# EAGLE design dus-lmt_breakout (EAGLE 7.7.0)
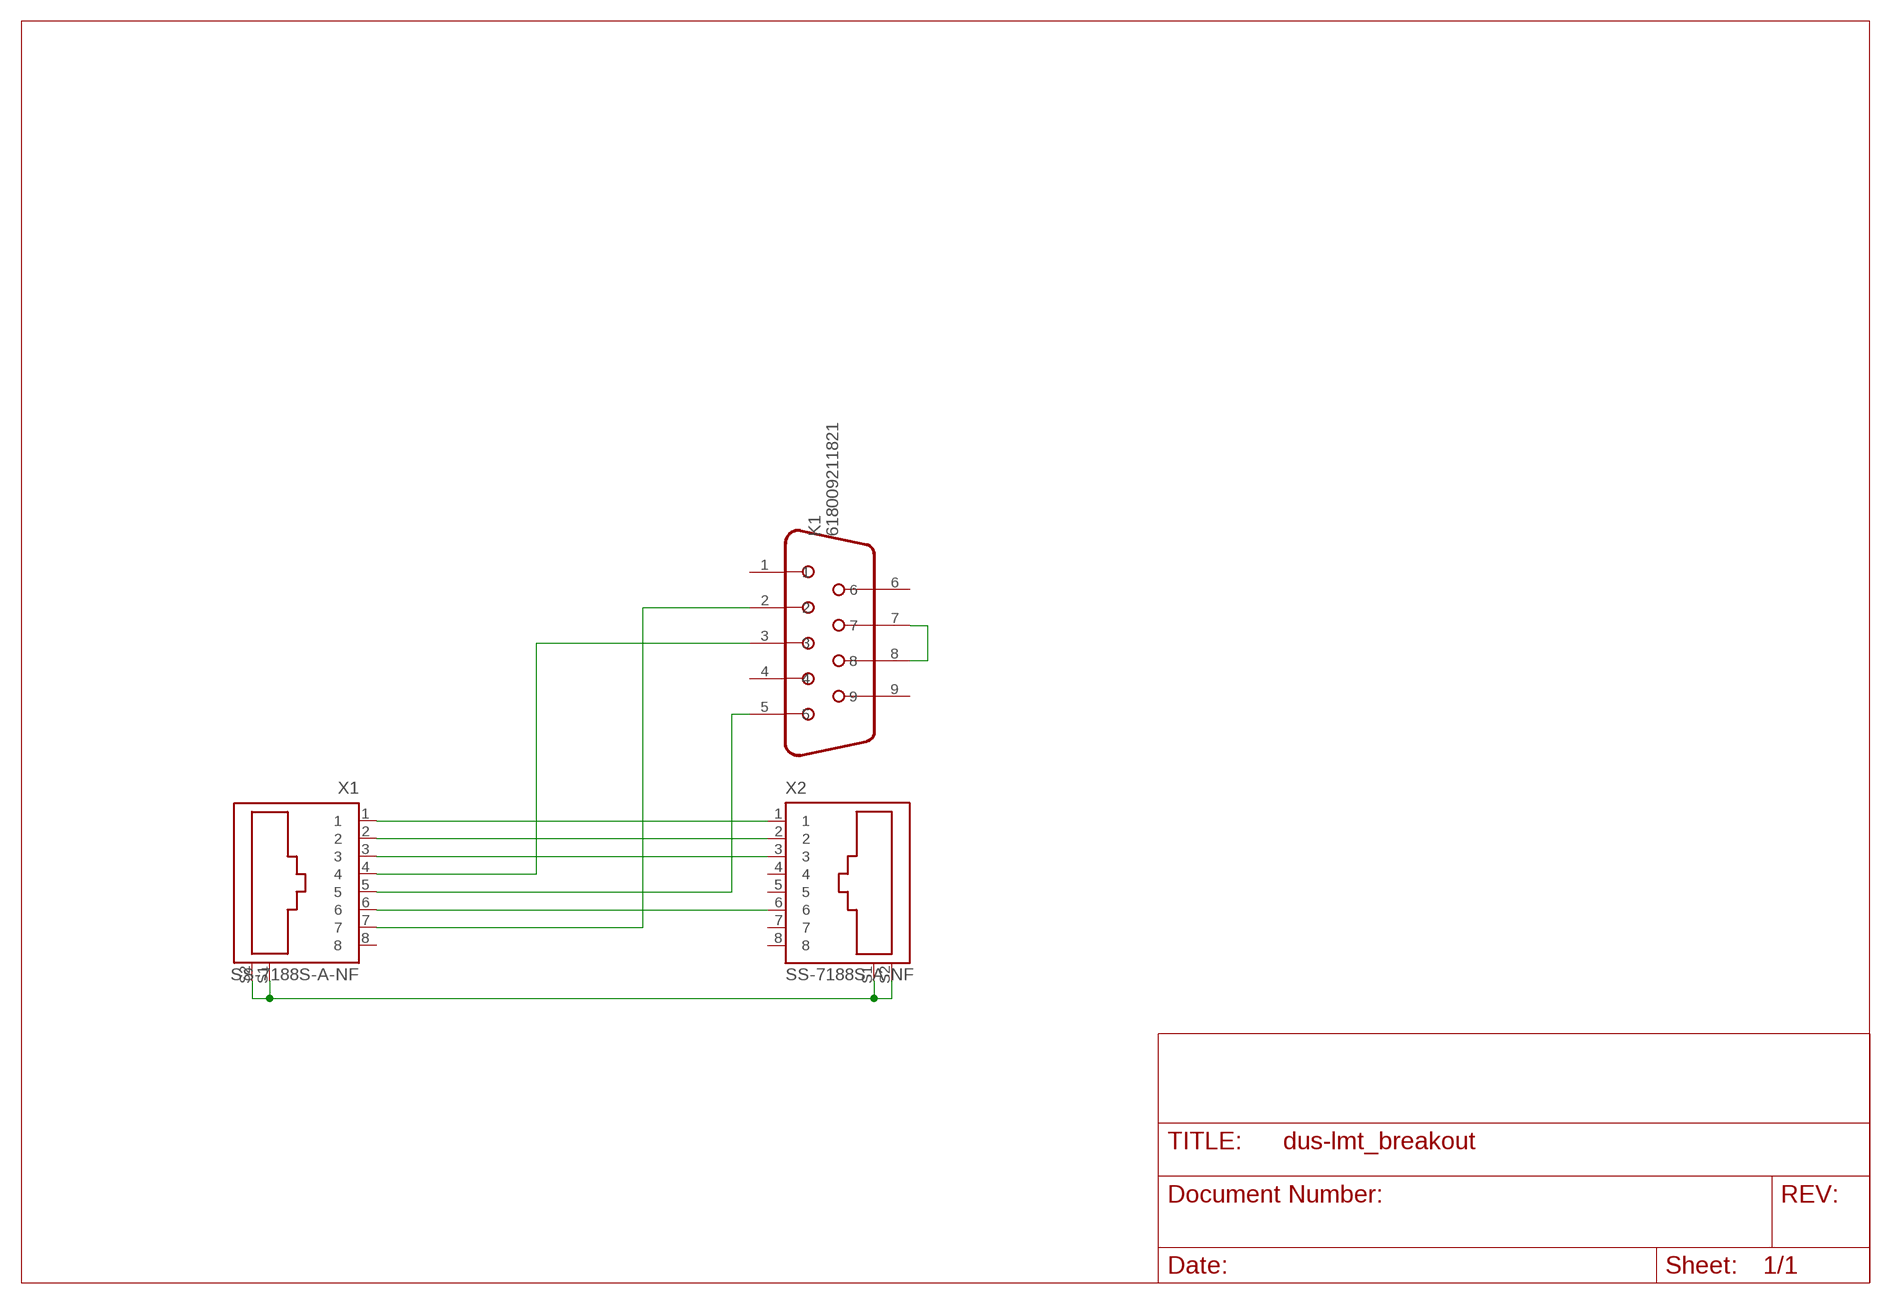
[diagram p0: schematic, sheet 1]

## Parts
K1  618009211821  [618009211821]
X1  SS-7188S-A-NF  [SS-7188S-A-NF]
X2  SS-7188S-A-NF  [SS-7188S-A-NF]

## Nets
GND: K1.5 X1.5
N$1: K1.7 K1.8
PAIR12_N: X1.2 X2.2
PAIR12_P: X1.1 X2.1
PAIR36_N: X1.6 X2.6
PAIR36_P: X1.3 X2.3
RS232_COMPUTER_RXD: K1.3 X1.4
RS232_COMPUTER_TXD: K1.2 X1.7
SHIIELD: X1.S1 X1.S2 X2.S1 X2.S2
Unconnected: K1.1 K1.4 K1.6 K1.9 X1.8 X2.4 X2.5 X2.7 X2.8

## Library data of the parts
K1 = Wuerth_Elektronik_eiCan_Communication_Connectors_v6_20150113:618009211821: WR-DSUB 8.08mm Female Angled PCB Connector without Hex Screw, 9 Pins=>Code : Con_I-O_DSUB_PCB_Female_wo-screw_6180xx211821 <http://katalog.we-online.de/media/images/eican/Con_I-O_DSUB_PCB_Female_wo-screw_6180xx211821_pf2.jpg> Details see: http://katalog.we-online.de/en/em/618_0xx_211_821 Created 2014-07-10, Karrer Zheng 2014 (C) Würth Elektronik
X1 X2 = stewart-rj45:SS-7188S-A-NF: Bel Stewart SS-7188S-A-NF RJ45 connector; MANUFACTURER: Bel Stewart; OC_DIGIKEY: 380-1047-ND

## Board
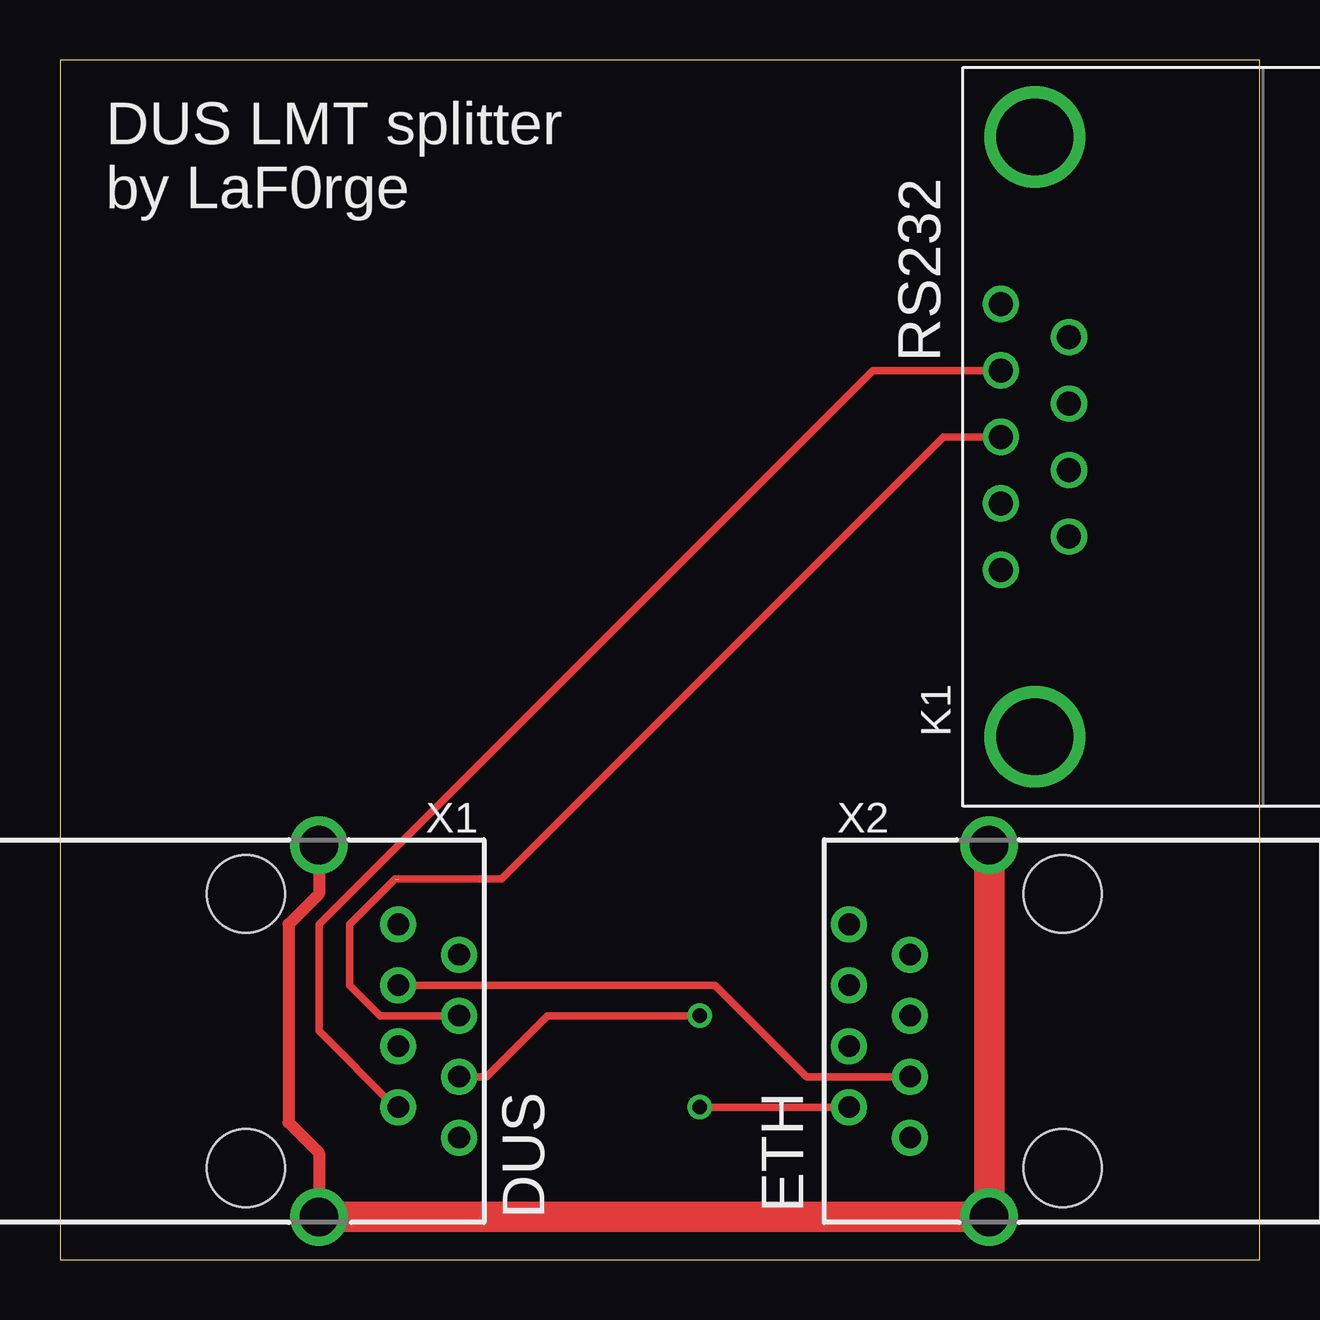
[diagram p1: board, top side]
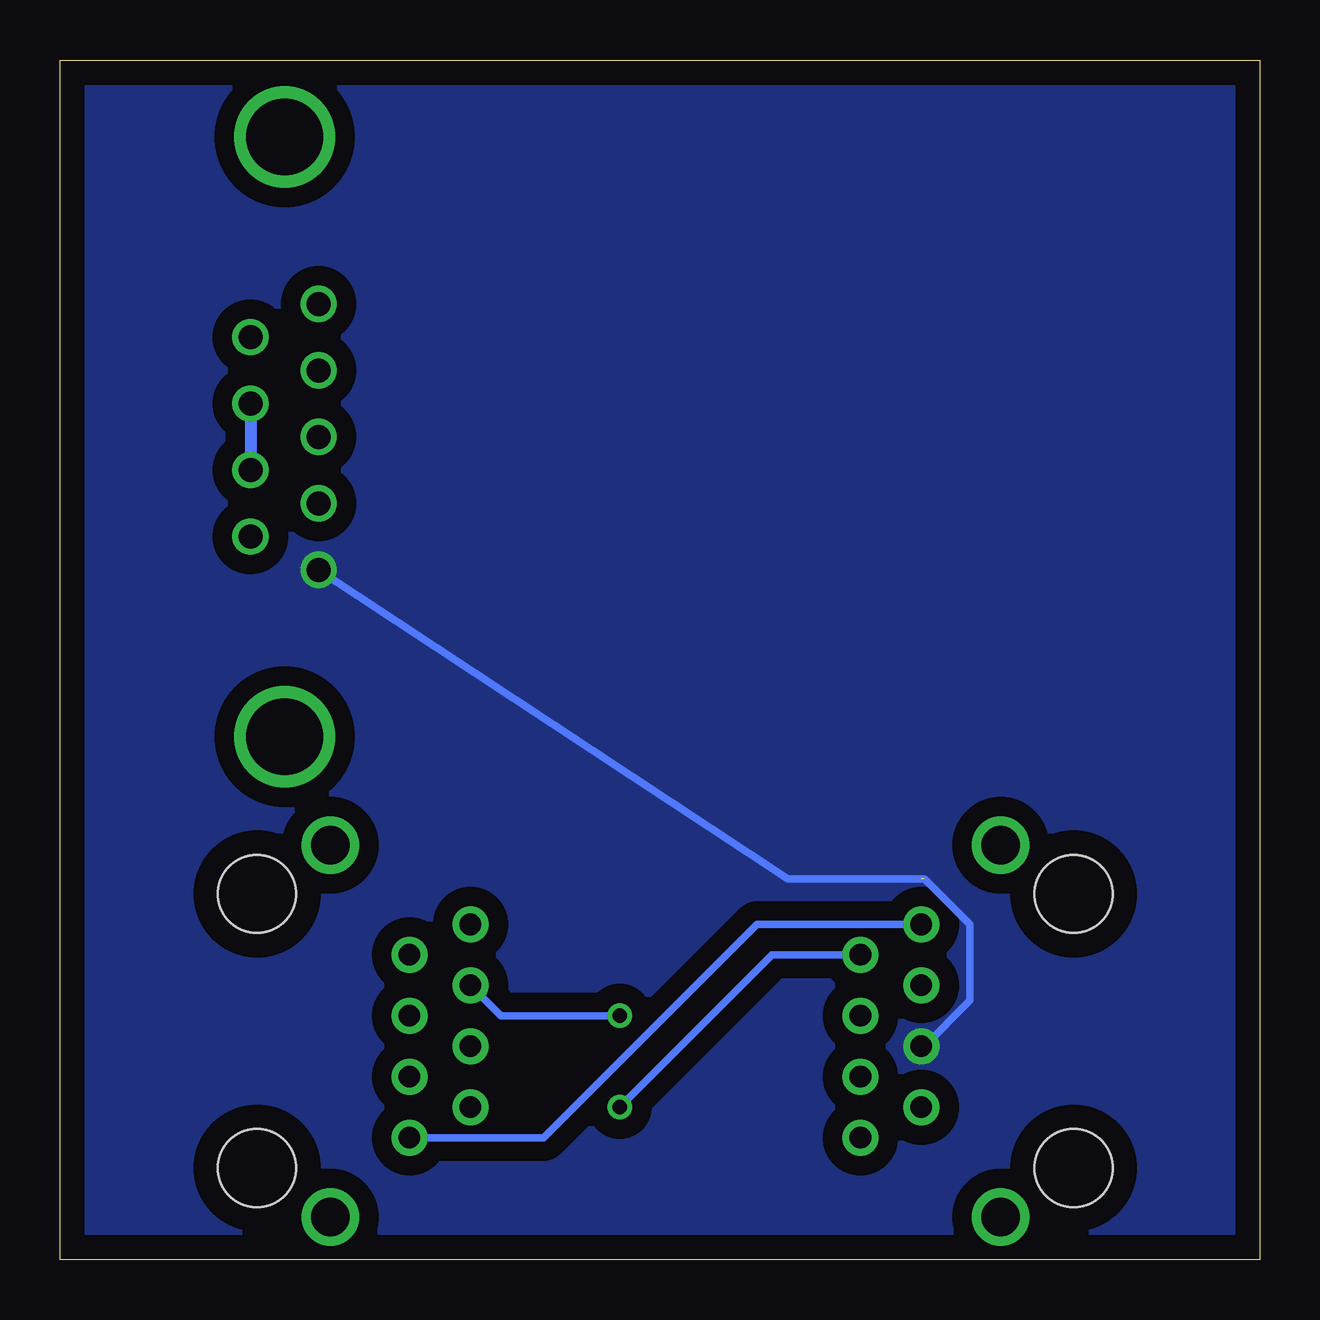
[diagram p2: board, bottom side, seen from below]

Size 50 x 50 mm. Coordinates in mm from the lower left corner, seen from the top.
Outline: 0,0 50,0 50,50 0,50 0,0
Copper layers (1*16): Top 0.035mm / dielectric 1.5mm / Bottom 0.035mm
Design rules "default *": minimum track width 0.5mm, minimum drill 24mil, track to track 8mil, track to pad 8mil, pad to pad 8mil, via to via 8mil, smd to smd 8mil, copper to edge 40mil, drill to drill 8mil, minimum pad ring 10mil, minimum via ring 8mil, stop-mask expansion 4mil, vias tented up to drill 0mil, thermal gap 10mil

### Footprints (pad centres in the part's own frame; a part is rotated, then mirrored left to right if it is on the bottom)
618009211821 = drill 1: 1 5.54,1.42; 2 2.77,1.42; 3 0,1.42; 4 -2.77,1.42; 5 -5.54,1.42; 6 4.155,-1.42; 7 1.385,-1.42; 8 -1.385,-1.42; 9 -4.155,-1.42 | drill 3.2: Z1 -12.5,0; Z2 12.5,0
SS-7188S-A-NF = drill 0.9 pad 1.5: 1 -4.445,4.572; 2 -3.175,7.112; 3 -1.905,4.572; 4 -0.635,7.112; 5 0.635,4.572; 6 1.905,7.112; 7 3.175,4.572; 8 4.445,7.112 | drill 1.6 pad 2.2: S1 -7.747,1.27; S2 7.747,1.27 | hole 3.251: -5.715,-1.778; 5.715,-1.778

### Placement (x,y rotation side)
K1  40.64,34.29 90 top
X1  9.53,9.53 270 top
X2  40.01,9.53 90 top

### Tracks (layer width: path | path; a pad name or v marks a point on that pad's centre or on a via)
GND
  Bottom 0.305: X1.5 13.97,8.89 12.06,10.79 12.06,13.97 13.97,15.88 19.66,15.88 K1.5
  pour Bottom (isolate 0.813, no thermals): 0,50.16 50.16,50.16 50.16,0 0,0
N$1
  Bottom 0.5: K1.7 K1.8
PAIR12_N  (via drill 0.61)
  Top 0.305: v26.67,6.35 X2.2
  Bottom 0.305: X1.2 20.32,12.7 v26.67,6.35
PAIR12_P
  Bottom 0.305: X1.1 20.95,13.97 29.84,5.08 X2.1
PAIR36_N  (via drill 0.61)
  Top 0.305: X1.6 17.78,7.62 20.32,10.16 v26.67,10.16
  Bottom 0.305: v26.67,10.16 31.62,10.16 X2.6
PAIR36_P
  Top 0.305: X1.3 27.3,11.43 31.11,7.62 X2.3
RS232_COMPUTER_RXD  (1 unrouted)
  Top 0.305: X1.4 13.34,10.16 12.06,11.43 12.06,13.97 13.97,15.88 | 14.12,15.88 18.41,15.88 36.83,34.29 K1.3
RS232_COMPUTER_TXD
  Top 0.305: 13.97,6.35 10.79,9.53 10.79,13.97 33.88,37.06 K1.2
  Top 0.5: X1.7 13.97,6.35
SHIIELD
  Top 0.5: X1.S1 10.79,15.24 9.53,13.97 9.53,5.71 10.79,4.45 X1.S2
  Top 1.27: X1.S2 X2.S1 X2.S2

### Text on the board
tPlace: RS232 | DUS LMT splitter / by LaF0rge | DUS | ETH